# Altium schematic sheet SWD & BOOT.SchDoc
size A
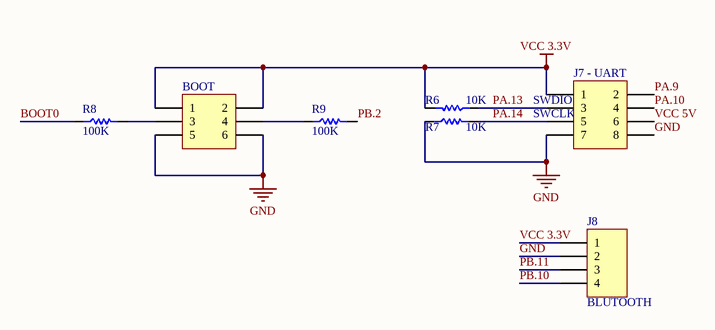
[diagram p0: SWD & BOOT.SchDoc]

## Parts
BOOT  Header 3X2  [HDR2X3]  (value not drawn)
J7_-_UART  Header 4X2  [HDR2X4]  (value not drawn)
J8  BLUTOOTH  [HDR1X4]
R6  10K  [SMD_RES_0805]
R7  10K  [SMD_RES_0805]
R8  100K  [SMD_RES_0805]
R9  100K  [SMD_RES_0805]

## Nets
GND: BOOT.5 BOOT.6 J7_-_UART.7 J7_-_UART.8 J8.2 R7.1
VCC 3.3V: BOOT.1 BOOT.2 J7_-_UART.1 J8.1 R6.2
BOOT0: R8.1
PA.9: J7_-_UART.2
PA.10: J7_-_UART.4
PA.13: J7_-_UART.3 R6.1
PA.14: J7_-_UART.5 R7.2
PB.2: R9.2
PB.10: J8.4
PB.11: J8.3
VCC 5V: J7_-_UART.6
NetBOOT_3: BOOT.3 R8.2
NetBOOT_4: BOOT.4 R9.1

## Notes on the sheet
- (near J7_-_UART) SWDIO
- (near J7_-_UART) SWCLK

## Library data of the parts
BOOT = Header 3X2: Header, 3-Pin, Dual row; LatestRevisionDate: 17-Jul-2002; LatestRevisionNote: Re-released for DXP Platform.; Publisher: Altium Limited
J7_-_UART = Header 4X2: Header, 4-Pin, Dual row; LatestRevisionDate: 17-Jul-2002; LatestRevisionNote: Re-released for DXP Platform.; Publisher: Altium Limited
J8 = Header 4: Header, 4-Pin; LatestRevisionDate: 17-Jul-2002; LatestRevisionNote: Re-released for DXP Platform.; Publisher: Altium Limited
R6-R9 = Resistor: Tolerance: 5%; Power: 1/8 W
  R6 R7: Value: 10K
  R8 R9: Value: 100K